# Altium schematic sheet transAmpV1_sch.SchDoc
size A4; SheetNumber: 1; SheetTotal: 2; SPICEModelCacheQFYSASON: <root> / <DocumentId>QFYSASON</DocumentId> / <CacheFrame Number="0"> / <Model Name="1n4001" Kind="MDL"> / <Text>*1N4001 MCE 8-16-95 / *50V 1A Si GenPurpose Diode pkg:DIODE0.4 1,2 / .MODEL 1N4001 D(IS=2.55E-9 RS=0.042 N=1.75 TT=5.76E-6 CJO=1.85E-11 / + VJ=0.75 M=0.333 BV=50 IBV=1E-5 )</Text> / </Model> / </CacheFrame> / </root>
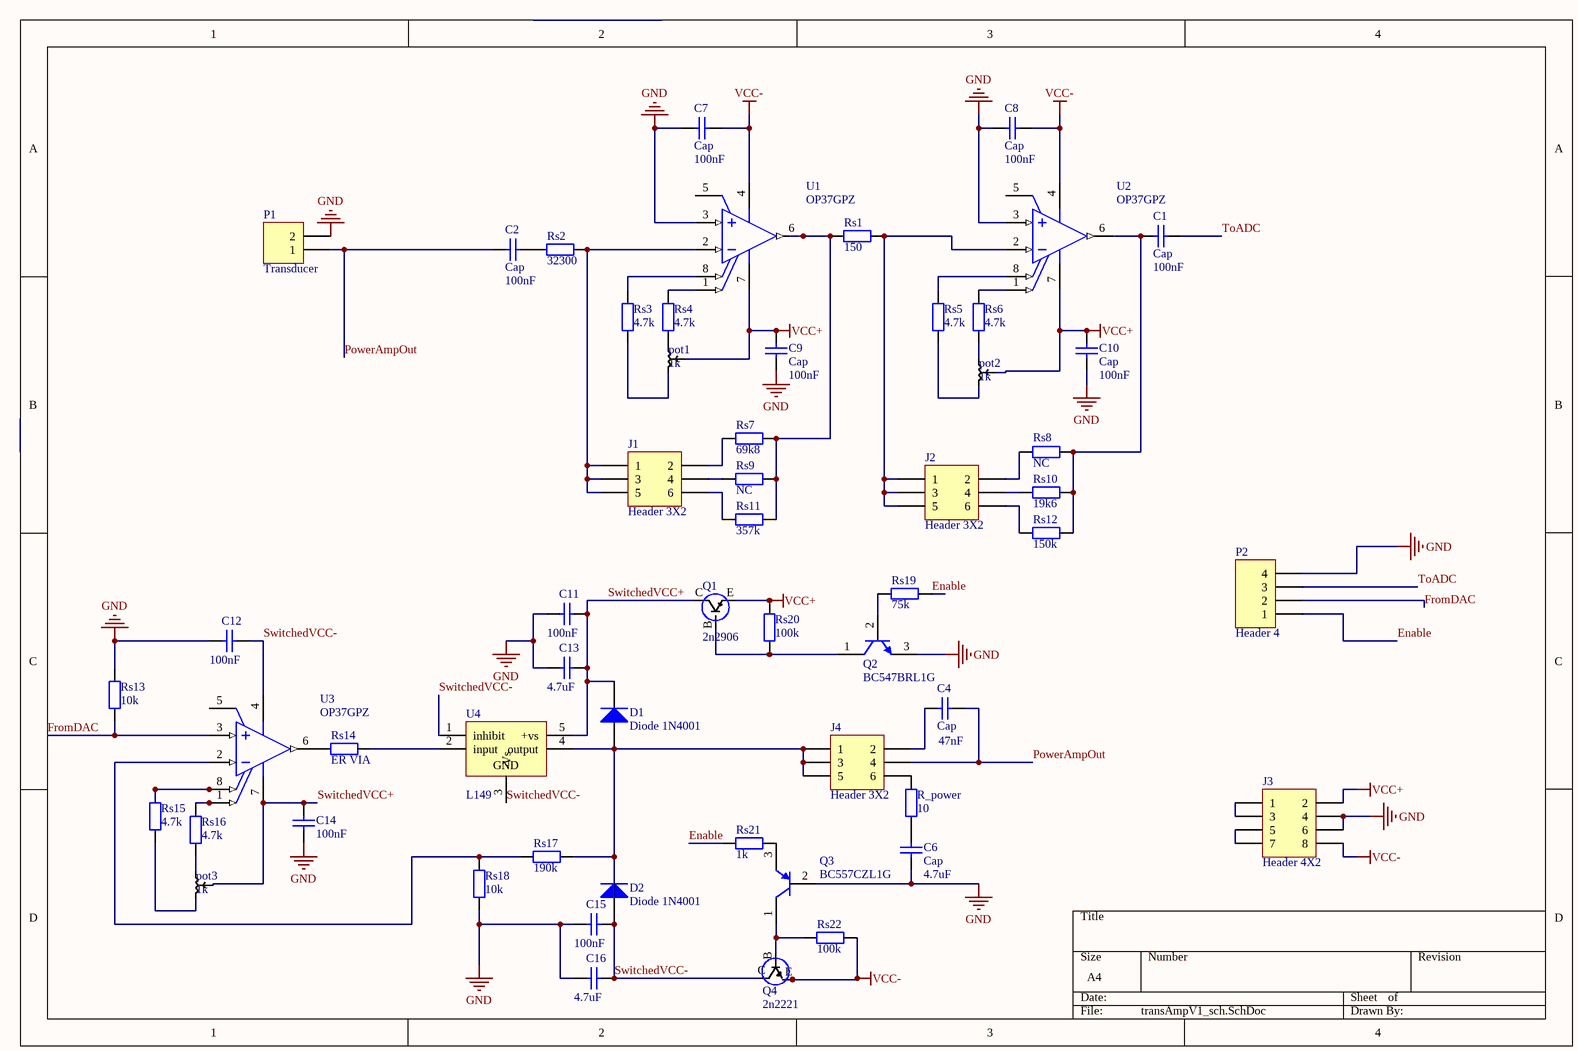
[diagram p0: transAmpV1_sch.SchDoc]

## Parts
C1  Cap  value 100nF  [RAD-0.2  PCBK]
C2  Cap  value 100nF  [RAD-0.2  PCBK]
C4  Cap  value 47nF  [RAD-0.2  PCBK]
C6  Cap  value 4.7uF  [RAD-0.2  PCBK]
C7  Cap  value 100nF  [RAD-0.2  PCBK]
C8  Cap  value 100nF  [RAD-0.2  PCBK]
C9  Cap  value 100nF  [RAD-0.2  PCBK]
C10  Cap  value 100nF  [RAD-0.2  PCBK]
C11  value 100nF  [RAD-0.2  PCBK]  (hidden comment: Cap)
C12  value 100nF  [RAD-0.2  PCBK]  (hidden comment: Cap)
C13  value 4.7uF  [RAD-0.2  PCBK]  (hidden comment: Cap)
C14  value 100nF  [RAD-0.2  PCBK]  (hidden comment: Cap)
C15  value 100nF  [RAD-0.2  PCBK]  (hidden comment: Cap)
C16  value 4.7uF  [RAD-0.2  PCBK]  (hidden comment: Cap)
D1  Diode 1N4001  [DO-41]
D2  Diode 1N4001  [DO-41]
J1  Header 3X2  [HDR2X3 PCBK]
J2  Header 3X2  [HDR2X3 PCBK]
J3  Header 4X2  [HDR2X4 PCBK]
J4  Header 3X2  [HDR2X3 PCBK]
P1  Transducer  [HDR1X2]
P2  Header 4  [HDR1X4]
pot1  1k  [potMeter_3328P]
pot2  1k  [potMeter_3328P]
pot3  1k  [potMeter_3328P]
Q1  2n2906  [TO-18]
Q2  BC547BRL1G  [ONSC-TO-92-3-29-11_AM_BL]
Q3  BC557CZL1G  [ONSC-TO-92-3-29-11_AM_BL]
Q4  2n2221  [TO-18]
R_power  10  [AXIAL-0.4 PCBK]
Rs1  150  [AXIAL-0.4 PCBK]
Rs2  32300  [AXIAL-0.4 PCBK]
Rs3  4.7k  [AXIAL-0.4 PCBK]
Rs4  4.7k  [AXIAL-0.4 PCBK]
Rs5  4.7k  [AXIAL-0.4 PCBK]
Rs6  4.7k  [AXIAL-0.4 PCBK]
Rs7  69k8  [AXIAL-0.4 PCBK]
Rs8  NC  [AXIAL-0.4 PCBK]
Rs9  NC  [AXIAL-0.4 PCBK]
Rs10  19k6  [AXIAL-0.4 PCBK]
Rs11  357k  [AXIAL-0.4 PCBK]
Rs12  150k  [AXIAL-0.4 PCBK]
Rs13  10k  [AXIAL-0.4 PCBK]
Rs14  ER VIA  [AXIAL-0.4 PCBK]
Rs15  4.7k  [AXIAL-0.4 PCBK]
Rs16  4.7k  [AXIAL-0.4 PCBK]
Rs17  190k  [AXIAL-0.4 PCBK]
Rs18  10k  [AXIAL-0.4 PCBK]
Rs19  75k  [AXIAL-0.4 PCBK]
Rs20  100k  [AXIAL-0.4 PCBK]
Rs21  1k  [AXIAL-0.4 PCBK]
Rs22  100k  [AXIAL-0.4 PCBK]
U1  OP37GPZ  [ADI-N-8]
U2  OP37GPZ  [ADI-N-8]
U3  OP37GPZ  [ADI-N-8]
U4  L149  [PentawattV]

## Nets
GND: C6.2 C7.1 C8.1 C9.2 C10.2 C11.1 C12.1 C13.1 C14.1 C15.1 C16.1 J3.4 J3.6 P1.2 P2.4 Q2.3(E) Q3.2(B) Rs13.1 Rs18.2 U1.3(+IN) U2.3(+IN)
VCC+: C9.1 C10.1 J3.2 pot1.2 pot2.2 Q1.E Rs20.2 U1.7(V+) U2.7(V+)
VCC-: C7.2 C8.2 J3.8 Q4.E Rs22.2 U1.4(V-) U2.4(V-)
Enable: P2.1 Rs19.1 Rs21.2
FromDAC: P2.2 Rs13.2 U3.3(+IN)
PowerAmpOut: C2.1 C4.2 J4.4 P1.1
SwitchedVCC+: C11.2 C13.2 C14.2 D1.2(K) pot3.2 Q1.C U3.7(V+) U4.5(+vs)
SwitchedVCC-: C12.2 C15.2 C16.2 D2.1(A) Q4.C U3.4(V-) U4.1(inhibit) U4.3(-Vs)
ToADC: C1.2 P2.3
NetC1_1: C1.1 Rs8.1 Rs10.1 Rs12.1 U2.6(OUT)
NetC2_2: C2.2 Rs2.2
NetC4_1: C4.1 J4.2
NetC6_1: C6.1 R_power.2
NetD1_1: D1.1(A) D2.2(K) J4.1 J4.3 J4.5 Rs17.1 U4.4(output)
NetJ1_1: J1.1 J1.3 J1.5 Rs2.1 U1.2(-IN)
NetJ1_2: J1.2 Rs7.2
NetJ1_4: J1.4 Rs9.2
NetJ1_6: J1.6 Rs11.2
NetJ2_1: J2.1 J2.3 J2.5 Rs1.1 U2.2(-IN)
NetJ2_2: J2.2 Rs8.2
NetJ2_4: J2.4 Rs10.2
NetJ2_6: J2.6 Rs12.2
NetJ3_1: J3.1 J3.3
NetJ3_5: J3.5 J3.7
NetJ4_6: J4.6 R_power.1
Netpot1_1: pot1.1 Rs4.1
Netpot1_3: pot1.3 Rs3.1
Netpot2_1: pot2.1 Rs6.1
Netpot2_3: pot2.3 Rs5.1
Netpot3_1: pot3.1 Rs16.1
Netpot3_3: pot3.3 Rs15.1
NetQ1_B: Q1.B Q2.1(C) Rs20.1
NetQ2_2: Q2.2(B) Rs19.2
NetQ3_1: Q3.1(C) Q4.B Rs22.1
NetQ3_3: Q3.3(E) Rs21.1
NetRs1_2: Rs1.2 Rs7.1 Rs9.1 Rs11.1 U1.6(OUT)
NetRs3_2: Rs3.2 U1.8(VOS_TRIM)
NetRs4_2: Rs4.2 U1.1(VOS_TRIM)
NetRs5_2: Rs5.2 U2.8(VOS_TRIM)
NetRs6_2: Rs6.2 U2.1(VOS_TRIM)
NetRs14_1: Rs14.1 U4.2(input)
NetRs14_2: Rs14.2 U3.6(OUT)
NetRs15_2: Rs15.2 U3.8(VOS_TRIM)
NetRs16_2: Rs16.2 U3.1(VOS_TRIM)
NetRs17_2: Rs17.2 Rs18.1 U3.2(-IN)

Not connected (* = marked no-connect by the designer): U1 5(NC); U2 5(NC); U3 5(NC)

## Notes on the sheet
- (in symbol CMP-0244-00411-1) GND

## Library data of the parts
C1 C2 C4 C6-C16 = Cap PCBK: Capacitor; Published: 8-Jun-2000; LatestRevisionDate: 17-Jul-2002; LatestRevisionNote: Re-released for DXP Platform.; PackageReference: RAD-0.3; Publisher: Altium Limited
D1 D2 = Diode 1N4001: 1 Amp General Purpose Rectifier; Published: 8-Jun-2000; LatestRevisionDate: 17-Jul-2002; LatestRevisionNote: Re-released for DXP Platform.; DatasheetVersion: 1998; PackageVersion: Aug-1999; PackageReference: DO-41; Publisher: Altium Limited; PackageDescription: Diode, Axial; Body 5.2 x 2.7 mm (LxDia. max), Lead Dia. 0.86 mm (max); Code_JEDEC: DO-204-AL; ComponentLink1Description: Manufacturer Link; ComponentLink1URL: http://www.fairchildsemi.com/; ComponentLink2Description: Datasheet; ComponentLink2URL: http://www.fairchildsemi.com/ds/1N%2F1N4001.pdf
J1 J2 J4 = Header 3X2 PBCK: Header, 3-Pin, Dual row; LatestRevisionDate: 17-Jul-2002; LatestRevisionNote: Re-released for DXP Platform.; Publisher: Altium Limited
J3 = Header 4X2 PBCK: Header, 4-Pin, Dual row; LatestRevisionDate: 17-Jul-2002; LatestRevisionNote: Re-released for DXP Platform.; Publisher: Altium Limited
P1 = Header 2: Header, 2-Pin; LatestRevisionDate: 17-Jul-2002; LatestRevisionNote: Re-released for DXP Platform.; Publisher: Altium Limited
P2 = Header 4: Header, 4-Pin; LatestRevisionDate: 17-Jul-2002; LatestRevisionNote: Re-released for DXP Platform.; Publisher: Altium Limited
pot1-pot3 = TrimPotOpAmp
Q1 = 2n2906: pin to pad: B>2 C>3 E>1
Q2 = CMP-1048-01605-1: Amplifier Transistor, NPN Silicon, 3-Pin TO-92, Pb-Free, Tape and Reel; Manufacturer: On Semiconductor; IC Continuous (A): 0.1; fT Min (MHz): 150; ComponentLink2URL: http://www.onsemi.com/pub_link/Collateral/BC546-D.PDF; ComponentLink1URL: http://www.onsemi.com/; ComponentLink2Description: Datasheet; RoHS: TRUE; ComponentLink3Description: Package Specification; ComponentLink1Description: Manufacturer URL; ComponentLink3URL: http://www.onsemi.com/pub_link/Collateral/MAC97-D.PDF; PackageDescription: 3-Pin Transistor Outline, Body 4.825 x 3.685 mm, Pitch 1.27 mm; Packing: Tape and Reel; PackageVersion: Rev. AM; Polarity: NPN; DatasheetVersion: Rev. 7; Mounting Technology: Through Hole; PackageReference: TO-92-3-29-11_AM_BL; PartNumber: BC547BRL1G
Q3 = CMP-1048-01521-1: Amplifier Transistor, PNP Silicon, 3-Pin TO-92, Pb-Free, Ammo Box; Manufacturer: On Semiconductor; IC Continuous (A): -0.1; ComponentLink2Description: Datasheet; ComponentLink1URL: http://www.onsemi.com/; Mounting Technology: Through Hole; PartNumber: BC557CZL1G; Packing: Ammo Box; DatasheetVersion: Rev. 3; PackageVersion: Rev. AM; ComponentLink3URL: http://www.onsemi.com/pub_link/Collateral/MAC97-D.PDF; ComponentLink1Description: Manufacturer URL; Polarity: PNP; RoHS: TRUE; PackageReference: TO-92-3-29-11_AM_BL; PackageDescription: 3-Pin Transistor Outline, Body 4.825 x 3.685 mm, Pitch 1.27 mm; ComponentLink2URL: http://www.onsemi.com/pub_link/Collateral/BC556B-D.PDF; ComponentLink3Description: Package Specification
Q4 = 2n2221: pin to pad: B>2 C>3 E>1
R_power Rs1-Rs22 = Res PCBK: Resistor; Value: 100; Published: 8-Jun-2000; LatestRevisionDate: 17-Jul-2002; LatestRevisionNote: Re-released for DXP Platform.; PackageReference: AXIAL-0.4; Publisher: Altium Limited
U1-U3 = CMP-0384-00210-1: Single Channel Low Noise Operational Amplifier, 63 MHz BW, 17 V/us SR, Industrial, 8-pin DIP (N-8), Tube; Generic Part Number: OP37; Manufacturer: Analog Devices; Amplifiers Per Package: 1; Slew Rate: 17V/us; Input Offset Voltage: 30uV; V Span Max: 44V; Small Signal Bandwidth: 63MHz; Iq/Amp: 5.67mA; V Span Min: 8V; Input Bias Current: 15nA; Mounting Technology: Through Hole; ComponentLink1URL: http://www.analog.com/en/index.html; ComponentLink2URL: http://www.analog.com/static/imported-files/data_sheets/OP37.pdf; DatasheetVersion: Rev. B; PartNumber: OP37GPZ; Packing: Tube; ComponentLink2Description: Datasheet; ComponentLink3Description: Package Specification; PackageDescription: 8-Pin Plastic Dual In-Line Package, Row spacing 7.62 mm, Pitch 2.54 mm; ComponentLink3URL: http:/www.analog.com/static/imported-files/packages/PKG_PDF/PDIP(N)/N_8.pdf; PackageVersion: 070606-A; Code_JEDEC: MS-001; PackageReference: N-8; ComponentLink1Description: Manufacturer URL
U4 = CMP-0244-00411-1: Adjustable Voltage and Current Regulator, 5-Pin Pentawatt, Tube; ComponentLink1Description: Manufacturer URL; ComponentLink1URL: http://www.st.com; PackageReference: PentawattV; PackageVersion: 1/02/2004; ComponentLink2Description: Datasheet; ComponentLink3URL: http://www.st.com/internet/com/TECHNICAL_RESOURCES/TECHNICAL_LITERATURE/PACKAGE_INFORMATION/CD00004635.pdf; DatasheetVersion: 1/01/2000; ComponentLink2URL: http://www.st.com/internet/com/TECHNICAL_RESOURCES/TECHNICAL_LITERATURE/DATASHEET/CD00000053.pdf; ComponentLink3Description: Package Specification; PackageDescription: TO, Thru-Hole, Vertical, Heatsink Mounted; 5 Bent Staggered Leads; Pitch 1.7 mm